# EAGLE schematic nixie-uhr-can (EAGLE 6.1)
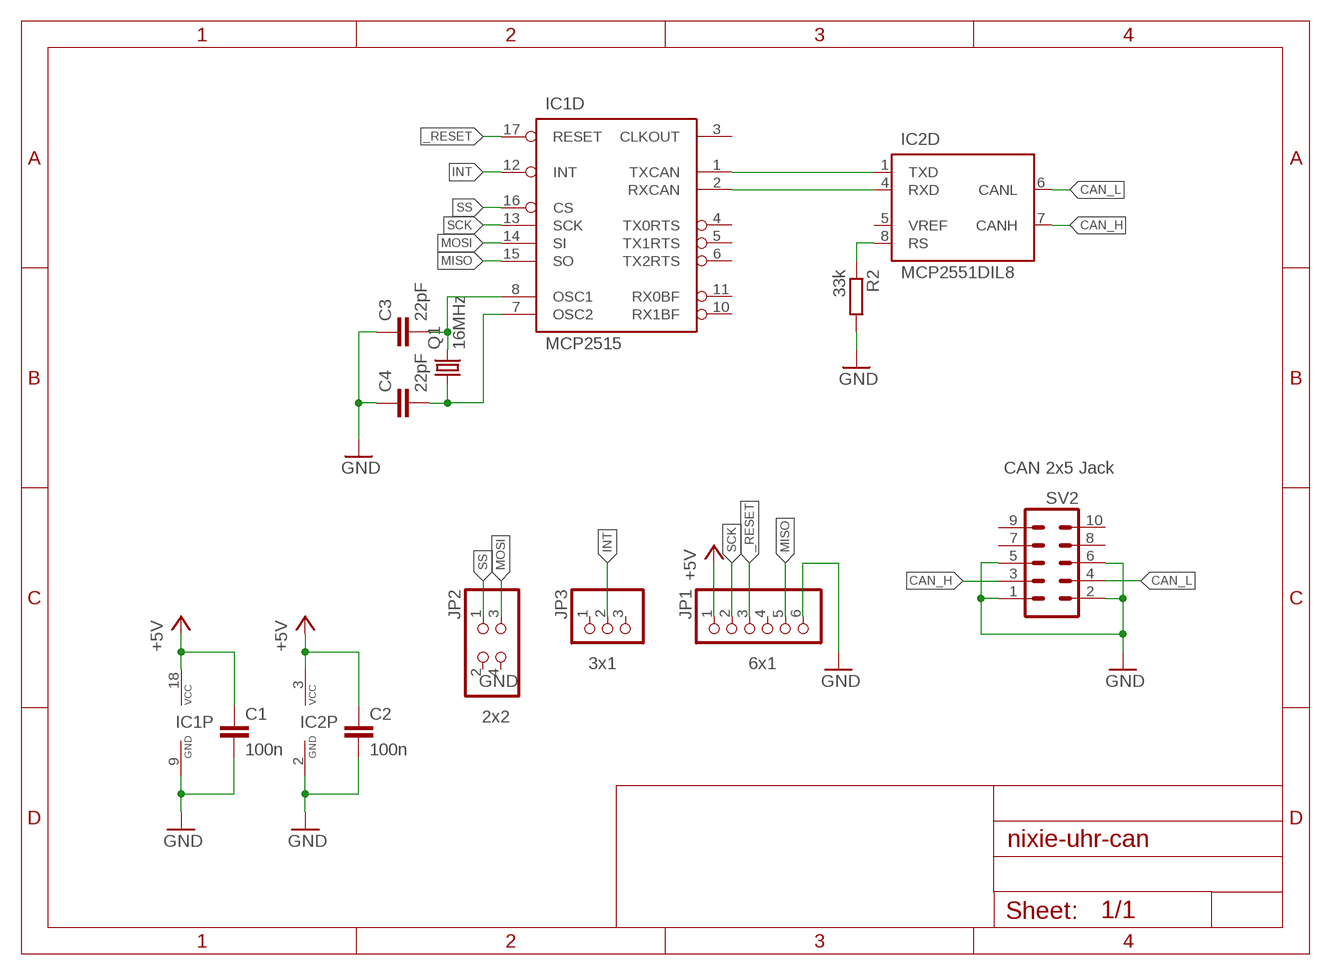
[diagram p0: schematic, sheet 1]

## Parts
C1  100n  C-EU050-024X044  [C050-024X044]
C2  100n  C-EU050-024X044  [C050-024X044]
C3  22pF  C-EUC0603  [C0603]
C4  22pF  C-EUC0603  [C0603]
IC1  MCP2515  MCP2515P  [DIL18]
IC2  MCP2551DIL8  [DIL08]
JP1  6x1  PINHD-1X6/90  [1X06/90]
JP2  2x2  PINHD-2X2  [2X02]
JP3  3x1  PINHD-1X3  [1X03]
Q1  16MHz  CRYSTALHC49UP  [HC49UP]
R2  33k  R-EU_0204/7  [0204/7]
SV2  CAN 2x5 Jack  ML10  [ML10]

## Nets
+5V: C1.1 C2.1 IC1.18(P:VCC) IC2.3(P:VCC) JP1.1
_RESET: IC1.17(D:RESET) JP1.3
CAN_H: IC2.7(D:CANH) SV2.3
CAN_L: IC2.6(D:CANL) SV2.4
GND: C1.2 C2.2 C3.1 C4.1 IC1.9(P:GND) IC2.2(P:GND) JP1.6 R2.2 SV2.1 SV2.2 SV2.5 SV2.6
INT: IC1.12(D:INT) JP3.2
MISO: IC1.15(D:SO) JP1.5
MOSI: IC1.14(D:SI) JP2.3
N$1: C3.2 IC1.8(D:OSC1) Q1.2
N$2: C4.2 IC1.7(D:OSC2) Q1.1
N$3: IC2.8(D:RS) R2.1
N$6: IC1.1(D:TXCAN) IC2.1(D:TXD)
N$7: IC1.2(D:RXCAN) IC2.4(D:RXD)
SCK: IC1.13(D:SCK) JP1.2
SS: IC1.16(D:CS) JP2.1
Unconnected: IC1.3(D:CLKOUT) IC1.4(D:TX0RTS) IC1.5(D:TX1RTS) IC1.6(D:TX2RTS) IC1.10(D:RX1BF) IC1.11(D:RX0BF) IC2.5(D:VREF) JP1.4 JP2.2 JP2.4 JP3.1 JP3.3 SV2.7 SV2.8 SV2.9 SV2.10

## Notes on the sheet
- GND

## Library data of the parts
C1 C2 = rcl:C-EU: CAPACITOR, European symbol
C3 C4 = resistor:C-EU: CAPACITOR, European symbol
IC1 = can:MCP2515: MC2515 Stand-Alone CAN Controller With SPI Interface, Microchip
IC2 = can:MCP2551: CAN Tranceiver Microchip
JP1 = pinhead:PINHD-1X6: PIN HEADER
JP2 = pinhead:PINHD-2X2: PIN HEADER
JP3 = pinhead:PINHD-1X3: PIN HEADER
Q1 = crystal:CRYSTAL: CRYSTAL; OC_FARNELL: unknown; OC_NEWARK: unknown
R2 = resistor:R-EU_: RESISTOR, European symbol
SV2 = con-ml:ML10: HARTING; OC_FARNELL: unknown; OC_NEWARK: unknown